# Altium schematic sheet PLD_Top.SchDoc: Top
size A4; ApprovedBy: Piotr Kuligowski; CheckedBy: Piotr Kuligowski; Author: Michał Gumiela; SheetNumber: 4; SheetTotal: 13
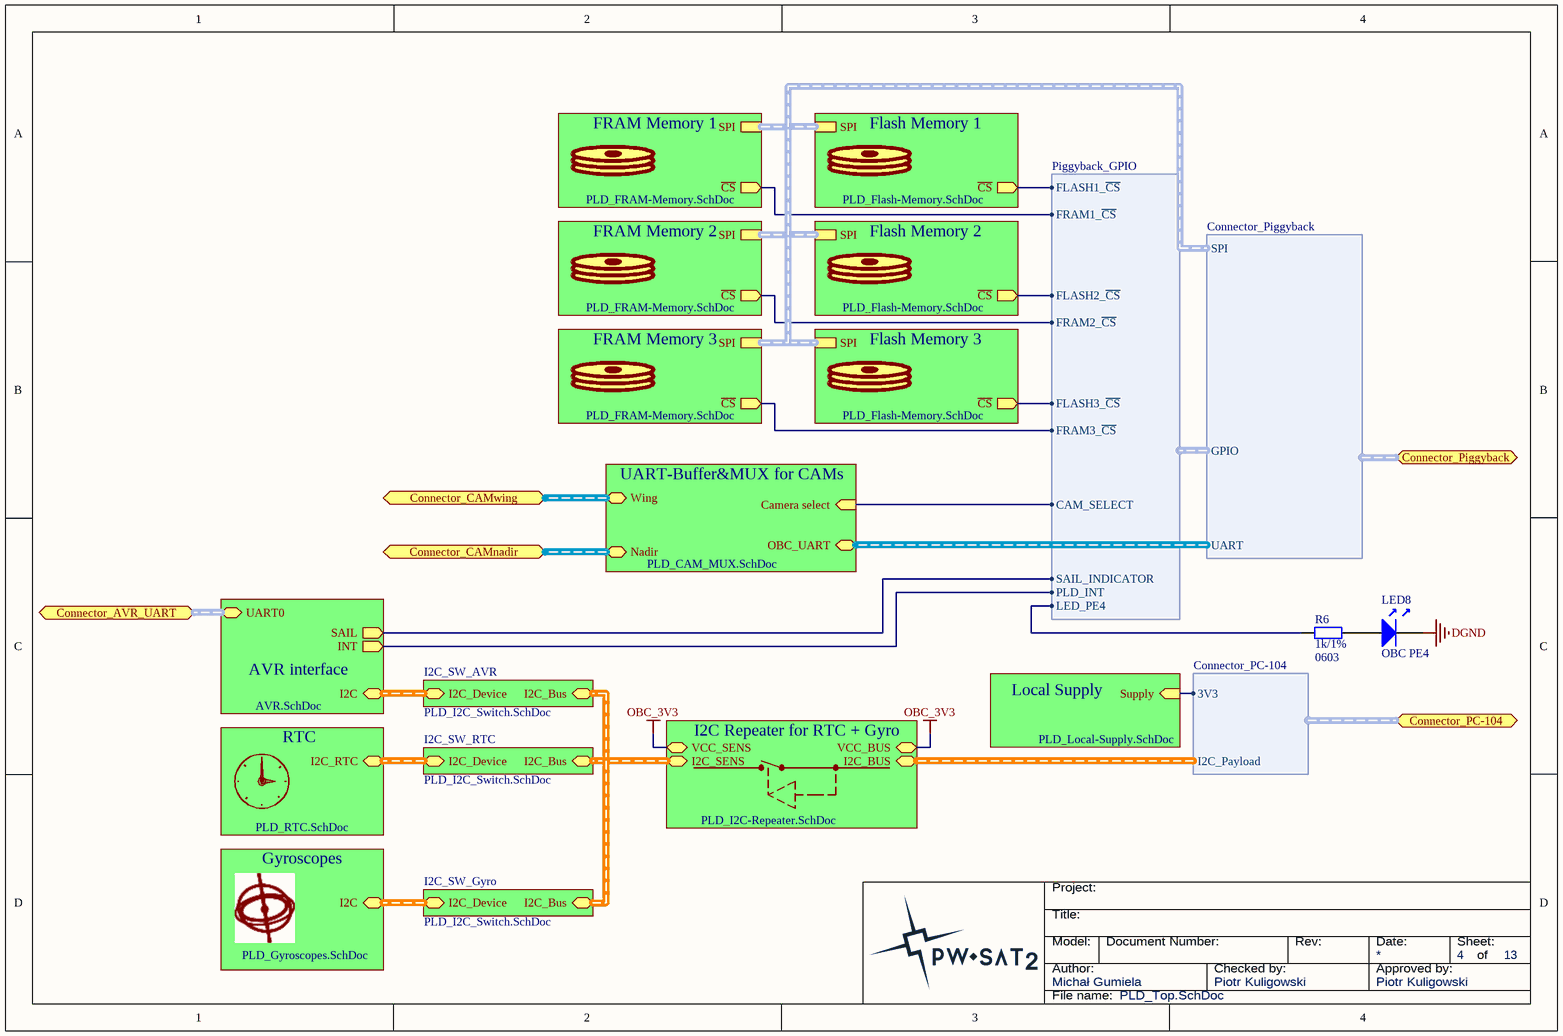
[diagram p0: PLD_Top.SchDoc]

## Parts
LED8  OBC PE4  [SMD_LED_1206]
R6  Package: 0603  [SMD_Resistor_0603]  (hidden comment: 1k/1%)

## Sub-sheets
AVR interface = AVR.SchDoc: I2C (harness I2C), INT (out), SAIL (out), UART0 (harness UART)
Flash Memory 1 = PLD_Flash-Memory.SchDoc: SPI (harness SPI), ~{CS} (out)
Flash Memory 2 = PLD_Flash-Memory.SchDoc: SPI (harness SPI), ~{CS} (out)
Flash Memory 3 = PLD_Flash-Memory.SchDoc: SPI (harness SPI), ~{CS} (out)
FRAM Memory 1 = PLD_FRAM-Memory.SchDoc: SPI (harness SPI), ~{CS} (out)
FRAM Memory 2 = PLD_FRAM-Memory.SchDoc: SPI (harness SPI), ~{CS} (out)
FRAM Memory 3 = PLD_FRAM-Memory.SchDoc: SPI (harness SPI), ~{CS} (out)
Gyroscopes = PLD_Gyroscopes.SchDoc: I2C (harness I2C)
I2C Repeater for RTC + Gyro = PLD_I2C-Repeater.SchDoc: I2C_BUS (harness I2C), VCC_SENS, VCC_BUS, I2C_SENS (harness I2C)
I2C_SW_AVR = PLD_I2C_Switch.SchDoc: I2C_Device (harness I2C), I2C_Bus (harness I2C)
I2C_SW_Gyro = PLD_I2C_Switch.SchDoc: I2C_Device (harness I2C), I2C_Bus (harness I2C)
I2C_SW_RTC = PLD_I2C_Switch.SchDoc: I2C_Device (harness I2C), I2C_Bus (harness I2C)
Local Supply = PLD_Local-Supply.SchDoc: Supply (in)
RTC = PLD_RTC.SchDoc: I2C_RTC (harness I2C)
UART-Buffer&MUX for CAMs = PLD_CAM_MUX.SchDoc: Camera select (in), OBC_UART (harness UART), Wing (harness CAM), Nadir (harness CAM)

## Ports
Connector_AVR_UART (harness UART), Connector_CAMnadir (harness Connector_CAM), Connector_CAMwing (harness Connector_CAM), Connector_PC-104 (harness Connector_PC-104), Connector_Piggyback (harness Connector_Piggyback)

## Harnesses
Connector_PC-104: I2C_Payload, 3V3
Connector_Piggyback: SPI, UART, GPIO
Piggyback_GPIO: CAM_SELECT, FLASH1_~{CS}, FRAM1_~{CS}, PLD_INT, FLASH2_~{CS}, FLASH3_~{CS}, FRAM2_~{CS}, FRAM3_~{CS}, SAIL_INDICATOR, LED_PE4

## Nets
DGND: LED8.K
OBC_3V3: sheet I2C Repeater for RTC + Gyro/VCC_SENS, sheet I2C Repeater for RTC + Gyro/VCC_BUS
NetLED8_A: LED8.A R6.2
NetR6_1: R6.1 ; harness Piggyback_GPIO.LED_PE4
(unnamed): sheet AVR interface/INT, harness Piggyback_GPIO.PLD_INT
(unnamed): sheet AVR interface/SAIL, harness Piggyback_GPIO.SAIL_INDICATOR
(unnamed): sheet UART-Buffer&MUX for CAMs/Camera select, harness Piggyback_GPIO.CAM_SELECT
(unnamed): sheet Local Supply/Supply, port Connector_PC-104.3V3
(unnamed): sheet Flash Memory 3/~{CS}, harness Piggyback_GPIO.FLASH3_~{CS}
(unnamed): sheet FRAM Memory 1/~{CS}, harness Piggyback_GPIO.FRAM1_~{CS}
(unnamed): sheet Flash Memory 2/~{CS}, harness Piggyback_GPIO.FLASH2_~{CS}
(unnamed): sheet Flash Memory 1/~{CS}, harness Piggyback_GPIO.FLASH1_~{CS}
(unnamed): sheet FRAM Memory 2/~{CS}, harness Piggyback_GPIO.FRAM2_~{CS}
(unnamed): sheet FRAM Memory 3/~{CS}, harness Piggyback_GPIO.FRAM3_~{CS}

## Buses and harness runs
harness port Connector_AVR_UART = sheet AVR interface/UART0
harness port Connector_CAMnadir = sheet UART-Buffer&MUX for CAMs/Nadir
harness port Connector_CAMwing = sheet UART-Buffer&MUX for CAMs/Wing
harness sheet AVR interface/I2C = sheet I2C_SW_AVR/I2C_Device
harness sheet Flash Memory 1/SPI = sheet Flash Memory 2/SPI = sheet Flash Memory 3/SPI = sheet FRAM Memory 1/SPI = sheet FRAM Memory 2/SPI = sheet FRAM Memory 3/SPI
harness sheet Gyroscopes/I2C = sheet I2C_SW_Gyro/I2C_Device
harness sheet I2C Repeater for RTC + Gyro/I2C_SENS = sheet I2C_SW_AVR/I2C_Bus = sheet I2C_SW_Gyro/I2C_Bus = sheet I2C_SW_RTC/I2C_Bus
harness sheet I2C_SW_RTC/I2C_Device = sheet RTC/I2C_RTC

## Notes on the sheet
- Title:
- Project:
- Author:
- Model:
- Document Number:
- Checked by:
- Rev:
- Date:
- Approved by:
- Sheet:
- of
- File name:

## Library data of the parts
LED8 = LED-1206_RED: LED diode, SMD1206 package.; Value: OBC PE4; Supplier 1: Farnell; Farnell: 1581229
R6 = CRCW06031K00FKxxxx: 1k/1% Vishay CRCW 0603 Resistor. 100mW, 100ppm, 75V.; Manufacturer: Vishay; ManufacturerPartNumber: CRCW06031K00FKxxxx; Value: 1k/1%